# Altium schematic sheet AmpCKT.SchDoc
size A
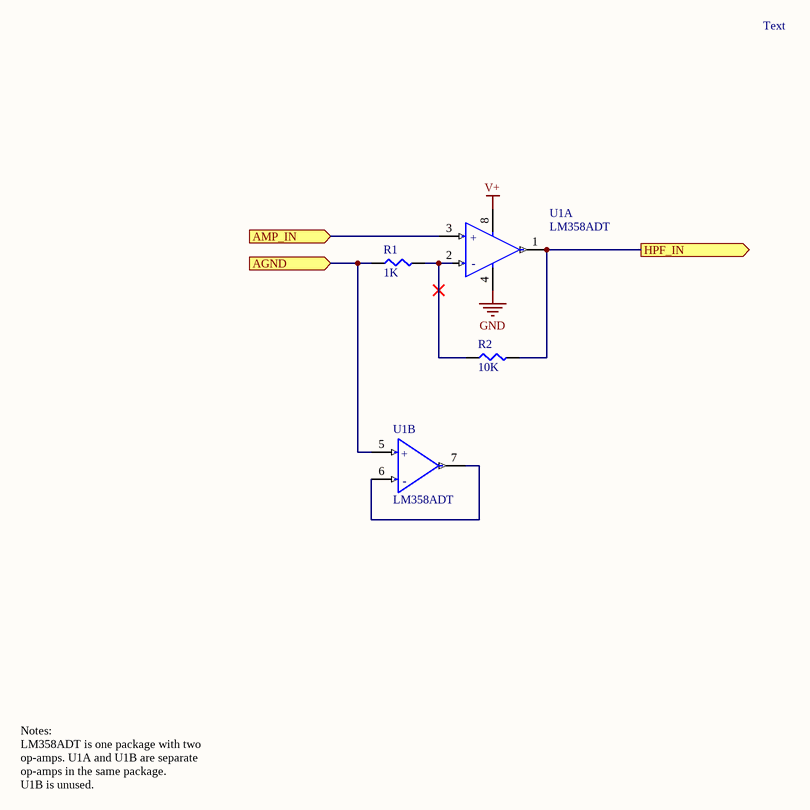
[diagram p0: AmpCKT.SchDoc]

## Parts
R1  1K  [SMD-0805-RES]
R2  10K  [SMD-0805-RES]
U1  LM358ADT  [FP-SO8-IPC_C]  (parts A,B of 2)

## Ports
AGND (in), AMP_IN (in), HPF_IN (out)

## Nets
GND: U1.4(VCC-)
V+: U1.8(VCC+)
AGND: R1.1 U1.5(In2+) ; port AGND
AMP_IN: U1.3(In1+) ; port AMP_IN
HPF_IN: R2.2 U1.1(Out1) ; port HPF_IN
NetR1_2: R1.2 R2.1 U1.2(In1-)
NetU1_6: U1.6(In2-) U1.7(Out2)

## Notes on the sheet
- Text
- Notes:
  LM358ADT is one package with two op-amps. U1A and U1B are separate op-amps in the same package.
  U1B is unused.
- (in symbol CMP-12131-000002-1, part A) +; -
- (in symbol CMP-12131-000002-1, part B) +; -

## Library data of the parts
R1 = ERJ-6ENF1001V: Manufacturer: Stackpole Electronics Inc; Manufacturer Part Number: RMCF0805FT1K00; Descriptions: 1 kOhms ±1% 0.125W, 1/8W Chip Resistor 0805 (2012 Metric) Automotive AEC-Q200 Thick Film; Datasheet Link: https://www.seielect.com/catalog/sei-rmcf_rmcp.pdf; Value: 1k; Operating Temperature: -55°C ~ 155°C; Package / Case: 0805 (2012 Metric)
R2 = ERJ-6ENF1002V: Manufacturer: Stackpole Electronics Inc; Manufacturer Part Number: RMCF0805JG10K0; Descriptions: 10 kOhms ±5% 0.125W, 1/8W Chip Resistor 0805 (2012 Metric) Automotive AEC-Q200 Thick Film; Datasheet Link: https://www.seielect.com/catalog/sei-rmcf_rmcp.pdf; Value: 10k; Operating Temperature: -55°C ~ 155°C; Package / Case: 0805 (2012 Metric)
U1 = CMP-12131-000002-1: Manufacturer Part Number: LM358WDT; Manufacturer: STMicroelectronics; Descriptions: General Purpose Amplifier 2 Circuit - 8-SOIC; RoHS: TRUE; Operating Temperature: 0°C ~ 70°C; Datasheet Link: https://www.st.com/content/ccc/resource/technical/document/datasheet/82/55/37/12/85/cc/4c/29/CD00003160.pdf/files/CD00003160.pdf/jcr:content/translations/en.CD00003160.pdf; Package / Case: 8-SOIC